# Altium schematic sheet LP_LED_CUBE_8x8x8.SchDoc
size A4
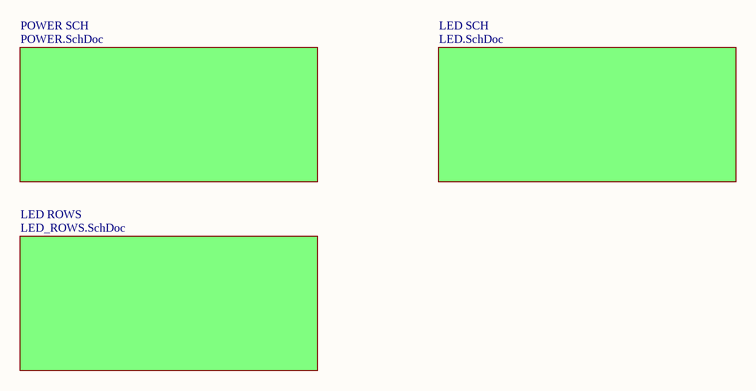
[diagram p0: LP_LED_CUBE_8x8x8.SchDoc]

## Sub-sheets
LED ROWS = LED_ROWS.SchDoc: no entries
LED SCH = LED.SchDoc: no entries
POWER SCH = POWER.SchDoc: no entries